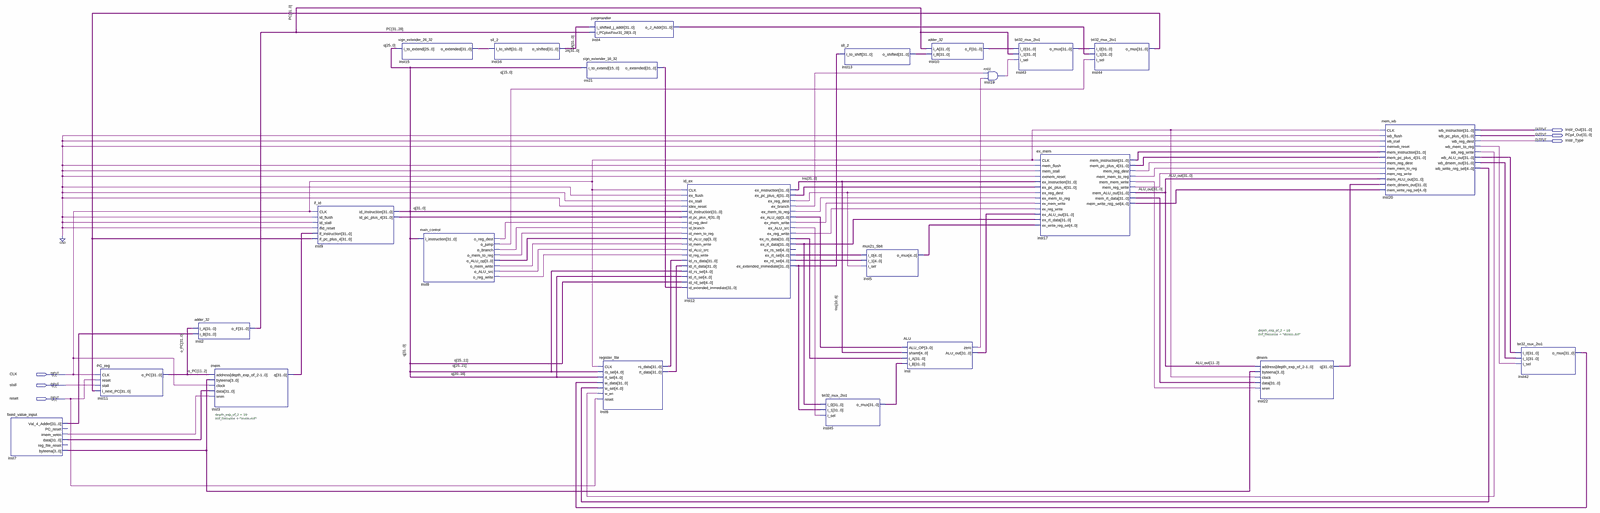
[diagram p0: schematic sheet, whole]
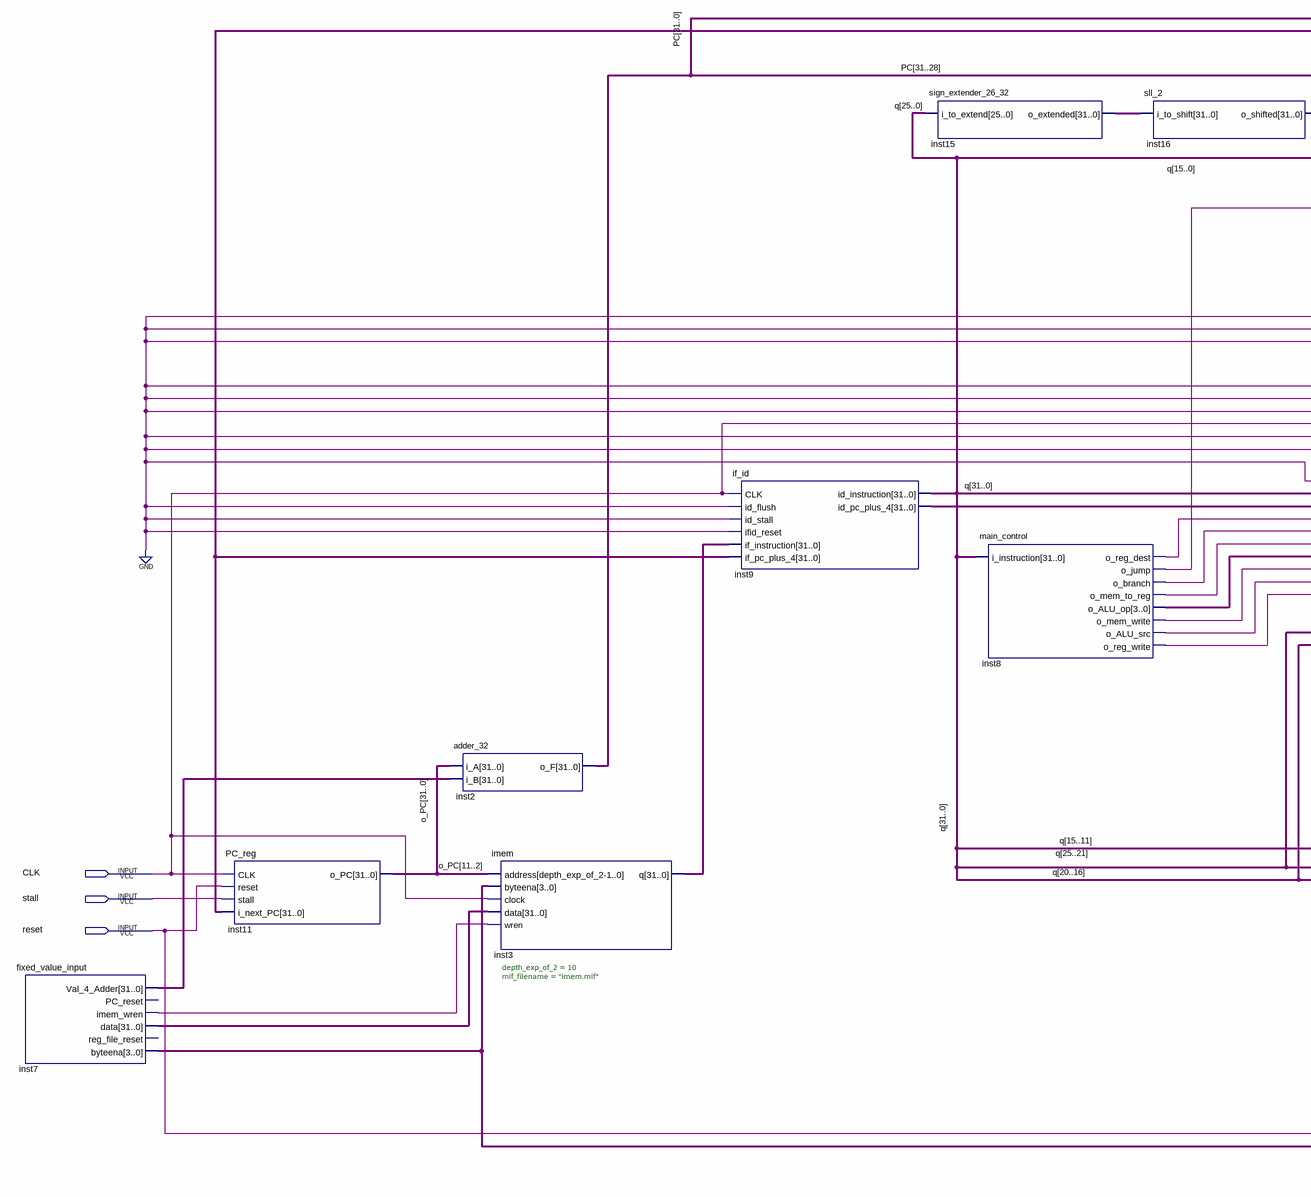
[diagram p1: schematic sheet, left part]
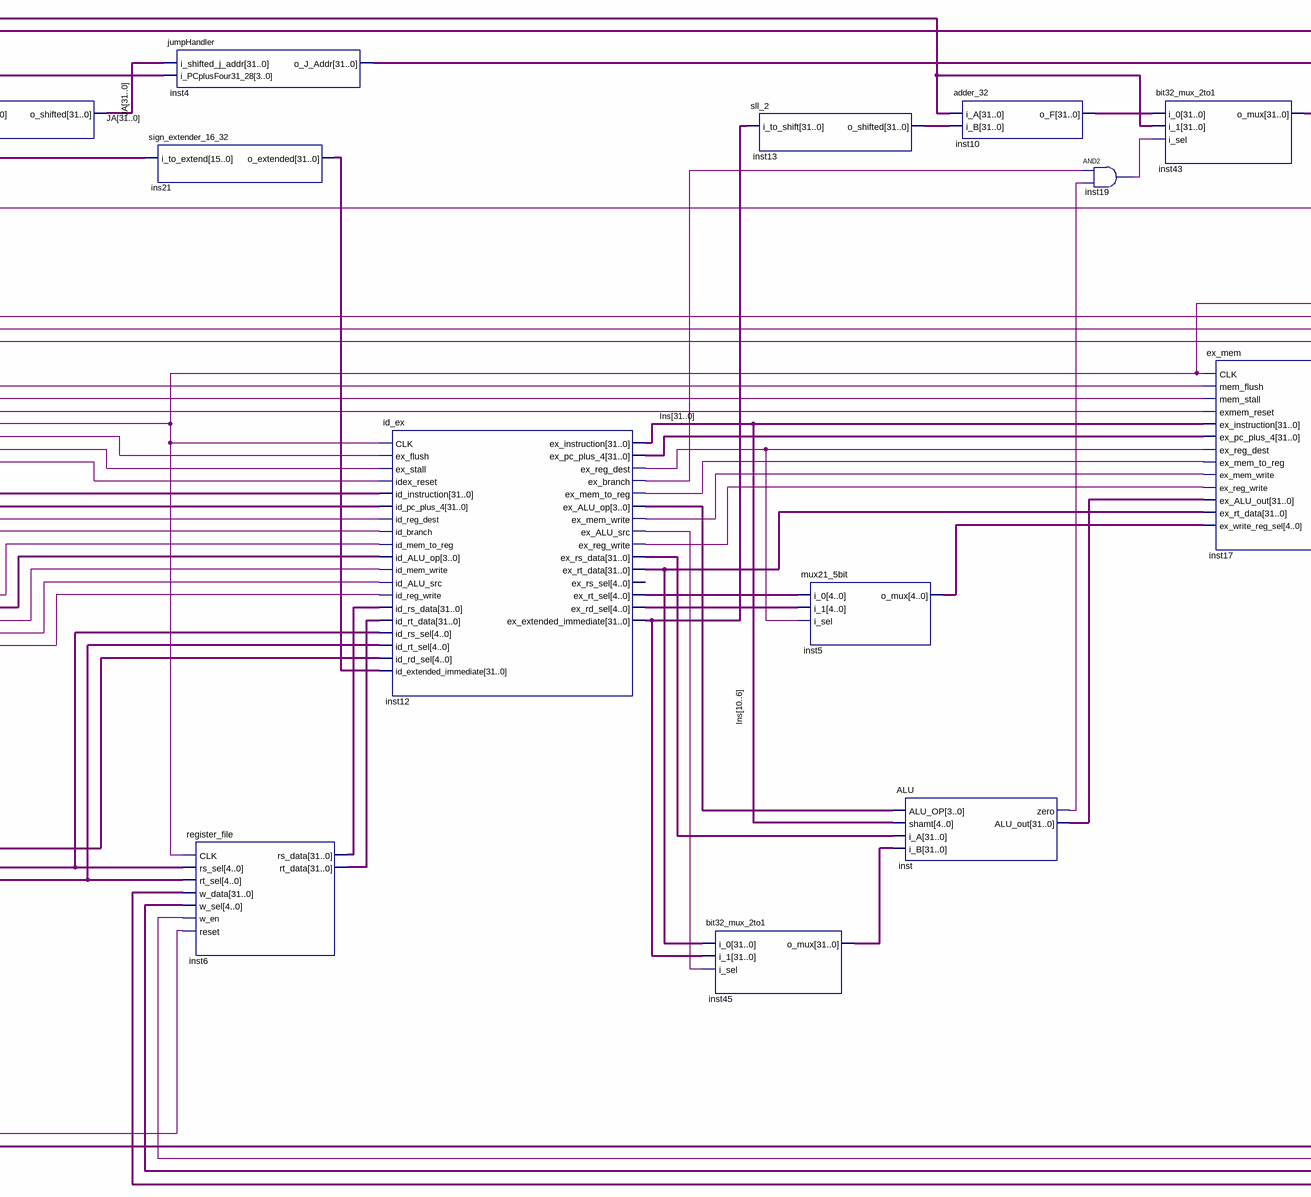
[diagram p2: schematic sheet, centre part]
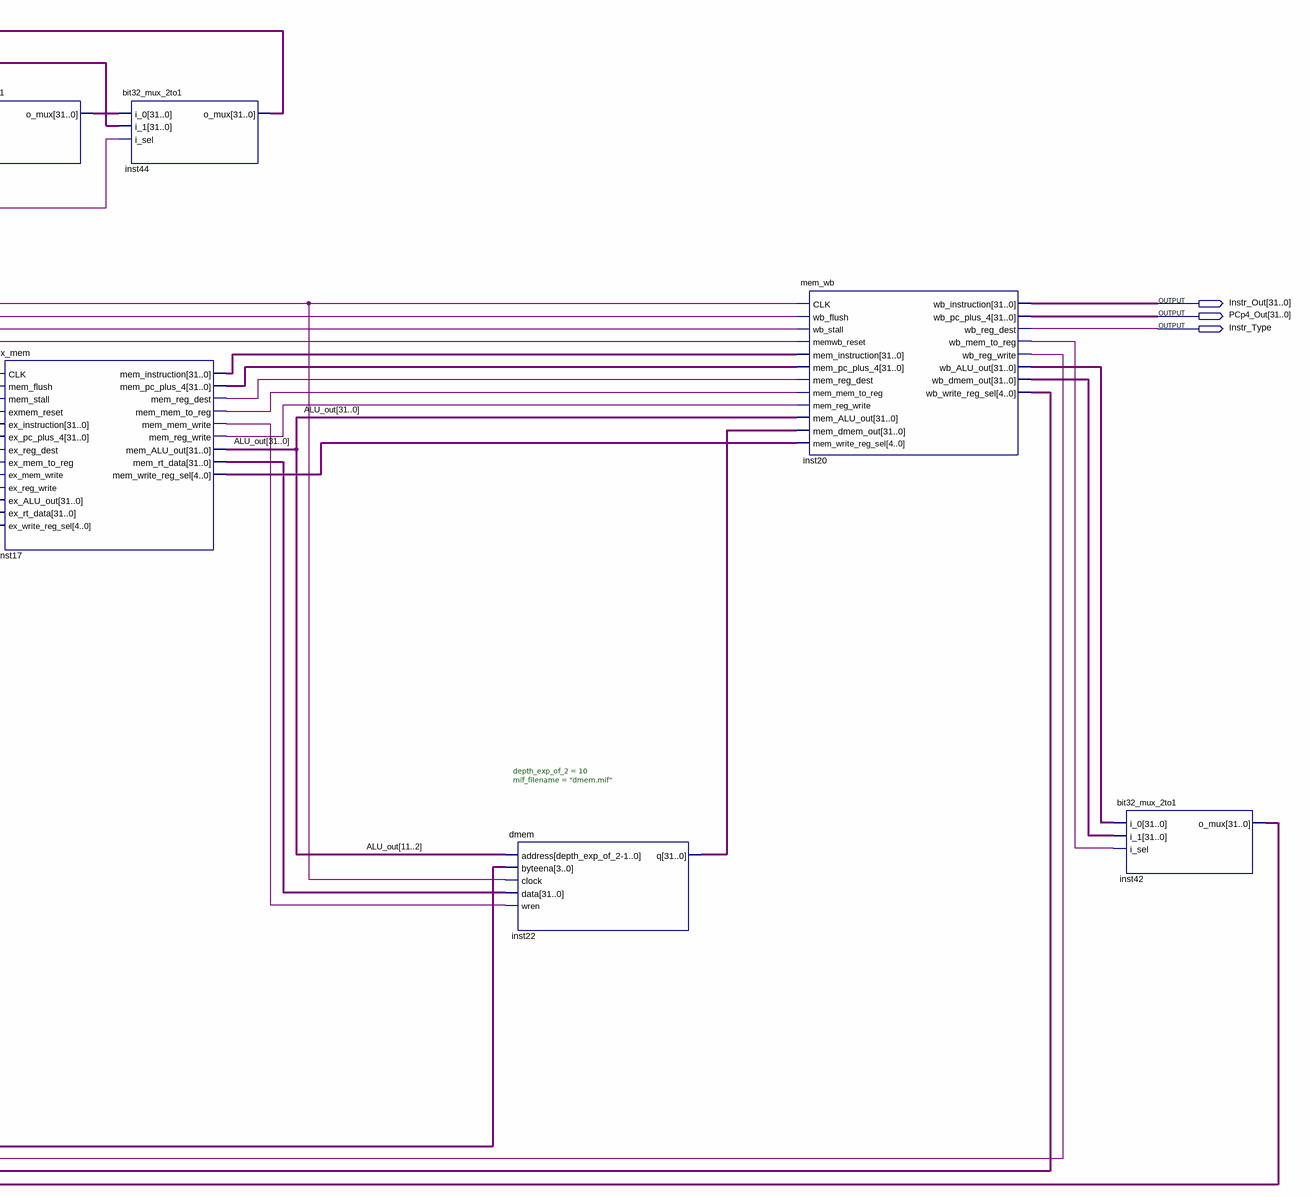
[diagram p3: schematic sheet, right part]
// Quartus schematic Pipeline_MIPS.bdf as structural Verilog: 24 symbols, 6 pins
module Pipeline_MIPS (
  input  CLK,
  input  stall,
  input  reset,
  output [31:0] Instr_Out,
  output [31:0] PCp4_Out,
  output Instr_Type
);

  wire inst7_imem_wren, inst8_o_alu_src, inst8_o_branch, inst8_o_jump, inst8_o_mem_to_reg, inst8_o_mem_write,
       inst8_o_reg_dest, inst8_o_reg_write, inst12_ex_alu_src, inst12_ex_branch, inst12_ex_mem_to_reg,
       inst12_ex_mem_write, inst12_ex_reg_dest, inst12_ex_reg_write, inst17_mem_mem_to_reg,
       inst17_mem_mem_write, inst17_mem_reg_dest, inst17_mem_reg_write, inst19_out, inst20_wb_mem_to_reg,
       inst20_wb_reg_write, inst_zero;
  wire [3:0] inst7_byteena, inst8_o_alu_op, inst12_ex_alu_op;
  wire [4:0] inst5_o_mux, inst12_ex_rd_sel, inst12_ex_rt_sel, inst17_mem_write_reg_sel,
       inst20_wb_write_reg_sel;
  wire [31:0] ALU_out, Ins, ins21_o_extended, inst3_q, inst4_o_j_addr, inst6_rs_data, inst6_rt_data,
       inst7_data, inst7_val_4_adder, inst9_id_pc_plus_4, inst10_o_f, inst12_ex_extended_immediate,
       inst12_ex_pc_plus_4, inst12_ex_rs_data, inst12_ex_rt_data, inst13_o_shifted, inst15_o_extended,
       inst17_mem_instruction, inst17_mem_pc_plus_4, inst17_mem_rt_data, inst20_wb_alu_out,
       inst20_wb_dmem_out, inst22_q, inst42_o_mux, inst43_o_mux, inst44_o_mux, inst45_o_mux, inst_alu_out,
       JA, o_PC, PC, q;

  fixed_value_input inst7 (
    .Val_4_Adder(inst7_val_4_adder), .imem_wren(inst7_imem_wren), .data(inst7_data), .byteena(inst7_byteena));  // open: PC_reset, reg_file_reset
  PC_reg inst11 (.CLK(CLK), .reset(reset), .stall(stall), .i_next_PC(inst44_o_mux), .o_PC(o_PC));
  adder_32 inst2 (.i_A(o_PC), .i_B(inst7_val_4_adder), .o_F(PC));
  imem #(.depth_exp_of_2(10), .mif_filename("imem.mif")) inst3 (
    .address(o_PC[11:2]), .byteena(inst7_byteena), .clock(CLK), .data(inst7_data), .wren(inst7_imem_wren),
    .q(inst3_q));
  if_id inst9 (
    .CLK(CLK), .id_flush(1'b0), .id_stall(1'b0), .ifid_reset(1'b0), .if_instruction(inst3_q),
    .if_pc_plus_4(inst44_o_mux), .id_instruction(q), .id_pc_plus_4(inst9_id_pc_plus_4));
  sign_extender_26_32 inst15 (.i_to_extend(q[25:0]), .o_extended(inst15_o_extended));
  main_control inst8 (
    .i_instruction(q), .o_reg_dest(inst8_o_reg_dest), .o_jump(inst8_o_jump), .o_branch(inst8_o_branch),
    .o_mem_to_reg(inst8_o_mem_to_reg), .o_ALU_op(inst8_o_alu_op), .o_mem_write(inst8_o_mem_write),
    .o_ALU_src(inst8_o_alu_src), .o_reg_write(inst8_o_reg_write));
  sll_2 inst16 (.i_to_shift(inst15_o_extended), .o_shifted(JA));
  jumpHandler inst4 (.i_shifted_j_addr(JA), .i_PCplusFour31_28(PC[31:28]), .o_J_Addr(inst4_o_j_addr));
  sign_extender_16_32 ins21 (.i_to_extend(q[15:0]), .o_extended(ins21_o_extended));
  register_file inst6 (
    .CLK(CLK), .rs_sel(q[25:21]), .rt_sel(q[20:16]), .w_data(inst42_o_mux), .w_sel(inst20_wb_write_reg_sel),
    .w_en(inst20_wb_reg_write), .reset(reset), .rs_data(inst6_rs_data), .rt_data(inst6_rt_data));
  id_ex inst12 (
    .CLK(CLK), .ex_flush(1'b0), .ex_stall(1'b0), .idex_reset(1'b0), .id_instruction(q),
    .id_pc_plus_4(inst9_id_pc_plus_4), .id_reg_dest(inst8_o_reg_dest), .id_branch(inst8_o_branch),
    .id_mem_to_reg(inst8_o_mem_to_reg), .id_ALU_op(inst8_o_alu_op), .id_mem_write(inst8_o_mem_write),
    .id_ALU_src(inst8_o_alu_src), .id_reg_write(inst8_o_reg_write), .id_rs_data(inst6_rs_data),
    .id_rt_data(inst6_rt_data), .id_rs_sel(q[25:21]), .id_rt_sel(q[20:16]), .id_rd_sel(q[15:11]),
    .id_extended_immediate(ins21_o_extended), .ex_instruction(Ins), .ex_pc_plus_4(inst12_ex_pc_plus_4),
    .ex_reg_dest(inst12_ex_reg_dest), .ex_branch(inst12_ex_branch), .ex_mem_to_reg(inst12_ex_mem_to_reg),
    .ex_ALU_op(inst12_ex_alu_op), .ex_mem_write(inst12_ex_mem_write), .ex_ALU_src(inst12_ex_alu_src),
    .ex_reg_write(inst12_ex_reg_write), .ex_rs_data(inst12_ex_rs_data), .ex_rt_data(inst12_ex_rt_data),
    .ex_rt_sel(inst12_ex_rt_sel), .ex_rd_sel(inst12_ex_rd_sel),
    .ex_extended_immediate(inst12_ex_extended_immediate));  // open: ex_rs_sel
  sll_2 inst13 (.i_to_shift(inst12_ex_extended_immediate), .o_shifted(inst13_o_shifted));
  bit32_mux_2to1 inst45 (
    .i_0(inst12_ex_rt_data), .i_1(inst12_ex_extended_immediate), .i_sel(inst12_ex_alu_src),
    .o_mux(inst45_o_mux));
  mux21_5bit inst5 (.i_0(inst12_ex_rt_sel), .i_1(inst12_ex_rd_sel), .i_sel(inst12_ex_reg_dest), .o_mux(inst5_o_mux));
  ALU inst (
    .ALU_OP(inst12_ex_alu_op), .shamt(Ins[10:6]), .i_A(inst12_ex_rs_data), .i_B(inst45_o_mux),
    .zero(inst_zero), .ALU_out(inst_alu_out));
  adder_32 inst10 (.i_A(PC), .i_B(inst13_o_shifted), .o_F(inst10_o_f));
  and inst19 (inst19_out, inst12_ex_branch, inst_zero);
  bit32_mux_2to1 inst43 (.i_0(inst10_o_f), .i_1(PC), .i_sel(inst19_out), .o_mux(inst43_o_mux));
  ex_mem inst17 (
    .CLK(CLK), .mem_flush(1'b0), .mem_stall(1'b0), .exmem_reset(1'b0), .ex_instruction(Ins),
    .ex_pc_plus_4(inst12_ex_pc_plus_4), .ex_reg_dest(inst12_ex_reg_dest),
    .ex_mem_to_reg(inst12_ex_mem_to_reg), .ex_mem_write(inst12_ex_mem_write),
    .ex_reg_write(inst12_ex_reg_write), .ex_ALU_out(inst_alu_out), .ex_rt_data(inst12_ex_rt_data),
    .ex_write_reg_sel(inst5_o_mux), .mem_instruction(inst17_mem_instruction),
    .mem_pc_plus_4(inst17_mem_pc_plus_4), .mem_reg_dest(inst17_mem_reg_dest),
    .mem_mem_to_reg(inst17_mem_mem_to_reg), .mem_mem_write(inst17_mem_mem_write),
    .mem_reg_write(inst17_mem_reg_write), .mem_ALU_out(ALU_out), .mem_rt_data(inst17_mem_rt_data),
    .mem_write_reg_sel(inst17_mem_write_reg_sel));
  bit32_mux_2to1 inst44 (.i_0(inst43_o_mux), .i_1(inst4_o_j_addr), .i_sel(inst8_o_jump), .o_mux(inst44_o_mux));
  dmem #(.depth_exp_of_2(10), .mif_filename("dmem.mif")) inst22 (
    .address(ALU_out[11:2]), .byteena(inst7_byteena), .clock(CLK), .data(inst17_mem_rt_data),
    .wren(inst17_mem_mem_write), .q(inst22_q));
  mem_wb inst20 (
    .CLK(CLK), .wb_flush(1'b0), .wb_stall(1'b0), .memwb_reset(1'b0),
    .mem_instruction(inst17_mem_instruction), .mem_pc_plus_4(inst17_mem_pc_plus_4),
    .mem_reg_dest(inst17_mem_reg_dest), .mem_mem_to_reg(inst17_mem_mem_to_reg),
    .mem_reg_write(inst17_mem_reg_write), .mem_ALU_out(ALU_out), .mem_dmem_out(inst22_q),
    .mem_write_reg_sel(inst17_mem_write_reg_sel), .wb_instruction(Instr_Out), .wb_pc_plus_4(PCp4_Out),
    .wb_reg_dest(Instr_Type), .wb_mem_to_reg(inst20_wb_mem_to_reg), .wb_reg_write(inst20_wb_reg_write),
    .wb_ALU_out(inst20_wb_alu_out), .wb_dmem_out(inst20_wb_dmem_out),
    .wb_write_reg_sel(inst20_wb_write_reg_sel));
  bit32_mux_2to1 inst42 (
    .i_0(inst20_wb_alu_out), .i_1(inst20_wb_dmem_out), .i_sel(inst20_wb_mem_to_reg), .o_mux(inst42_o_mux));
endmodule
